# EAGLE schematic HF (EAGLE 6.5.0)
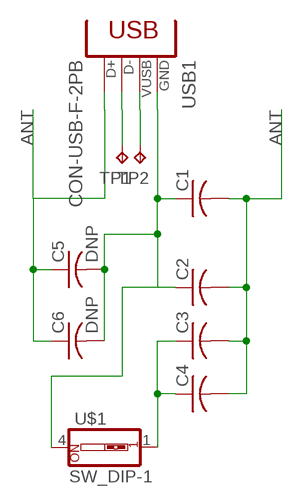
[diagram p0: schematic, sheet 1]

## Parts
C1  C-USC1206  [C1206]
C2  C-USC1206  [C1206]
C3  C-USC1206  [C1206]
C4  C-USC1206  [C1206]
C5  DNP  C-USC1206  [C1206]
C6  DNP  C-USC1206  [C1206]
TP1  TPPAD1-13  [P1-13]
TP2  TPPAD1-13  [P1-13]
U$1  SW_DIP-1  [DIPSWITCH-01]
USB1  CON-USB-F-2PB  [CONN_USB_A_F]

## Nets
ANT: C1.2 C2.2 C3.2 C4.2 C5.1 C6.1 USB1.3(D+)
N$1: C1.1 C2.1 C5.2 C6.2 U$1.4 USB1.4(GND)
N$2: C3.1 C4.1 U$1.1
N$3: TP1.TP USB1.2(D-)
N$4: TP2.TP USB1.1(VUSB)
Unconnected: USB1.B1(BODY) USB1.B2(BODY)

## Library data of the parts
C1-C6 = rcl:C-US: CAPACITOR, American symbol
TP1 TP2 = testpad:TP: Test pad
U$1 = SparkFun-Electromechanical:SW_DIP-1
USB1 = dp_devices:CON-USB-F-2PB: USB Female connector with 2 body pins